# Altium project EEG.PrjPCB
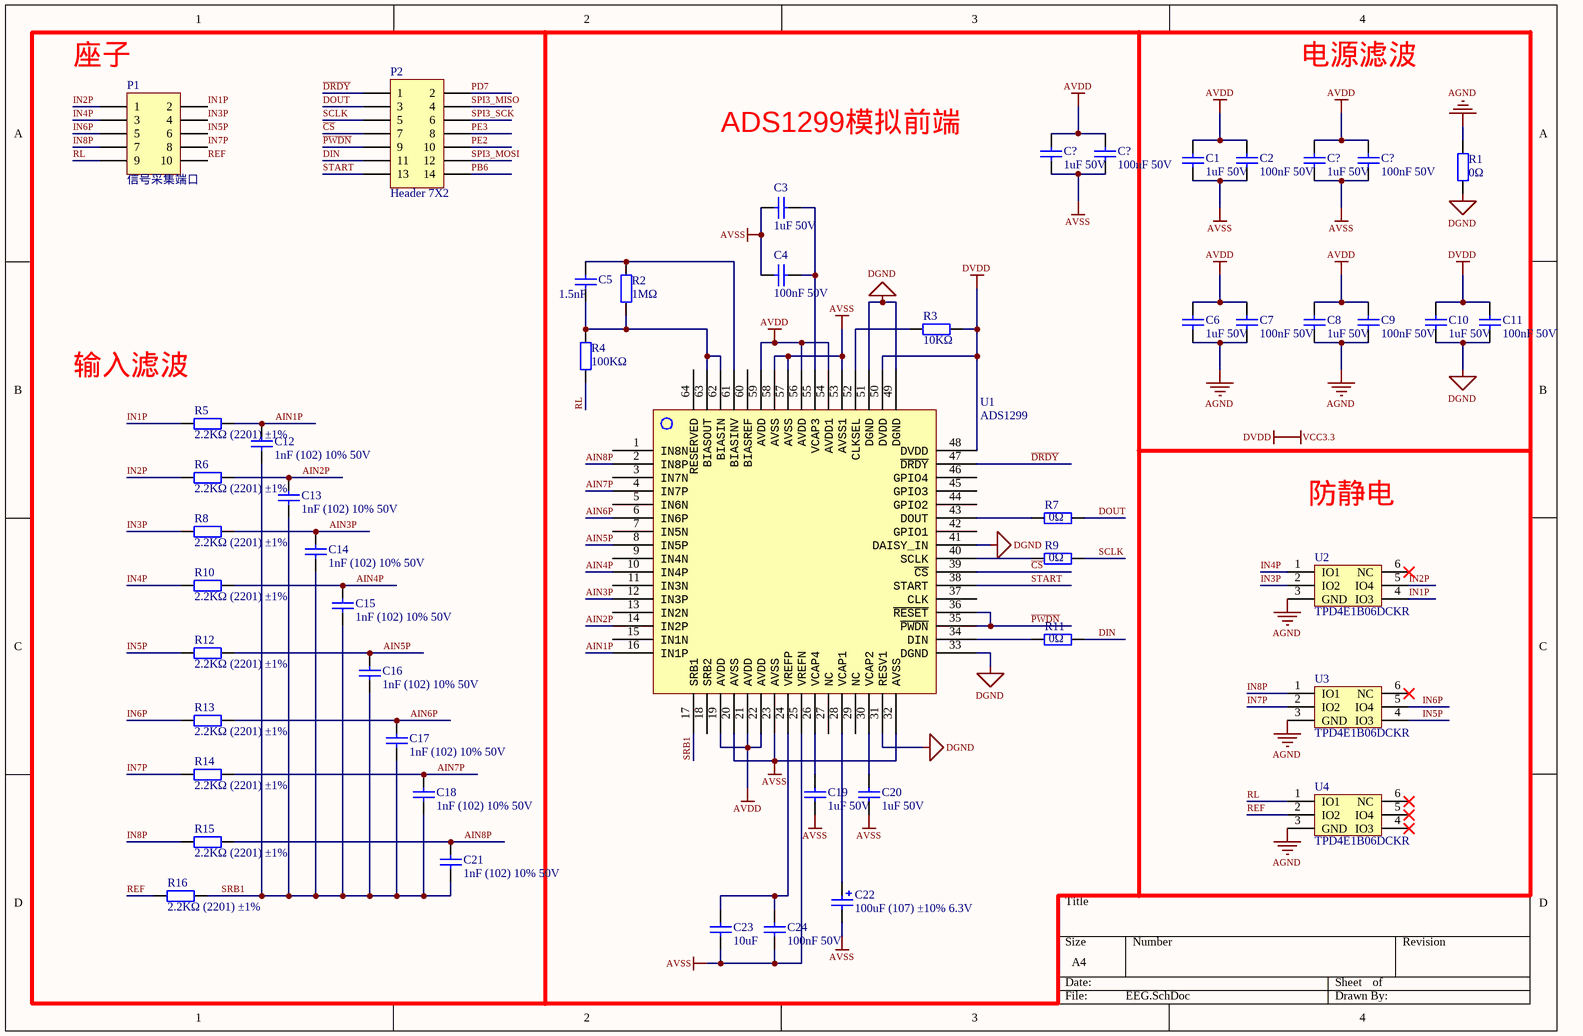
[diagram p0: EEG.SchDoc]
4 sheets, 168 parts. Net scope: global (net labels, ports and power ports of the same name join across sheets).
Board files: logo.PcbDoc, EEG_V3.0.PcbDoc
Sheets:
  EEG.SchDoc
  STM32F4.SchDoc
  pwr.SchDoc
  ble.SchDoc

## Sheet EEG.SchDoc
size A4

### Parts
(Parts that share a designator on the sheet are numbered #1, #2 ... from top to bottom, then left to right.)
C1#1  1uF 50V  [0402_C]
C2#1  100nF 50V  [0402_C]
C3#1  1uF 50V  [0402_C]
C4#1  100nF 50V  [0402_C]
C5#1  1.5nF  [0402_C]
C6#1  1uF 50V  [0402_C]
C7#1  100nF 50V  [0402_C]
C8#1  1uF 50V  [0402_C]
C9#1  100nF 50V  [0402_C]
C10#1  1uF 50V  [0402_C]
C11#1  100nF 50V  [0402_C]
C12#1  1nF (102) 10% 50V  [0402_C]
C13#1  1nF (102) 10% 50V  [0402_C]
C14#1  1nF (102) 10% 50V  [0402_C]
C15#1  1nF (102) 10% 50V  [0402_C]
C16#1  1nF (102) 10% 50V  [0402_C]
C17#1  1nF (102) 10% 50V  [0402_C]
C18#1  1nF (102) 10% 50V  [0402_C]
C19#1  1uF 50V  [0402_C]
C20#1  1uF 50V  [0402_C]
C21#1  1nF (102) 10% 50V  [0402_C]
C22#1  100uF (107) ±10% 6.3V  [CASE-B_3528]
C23#1  10uF  [0402_C]
C24#1  100nF 50V  [0402_C]
C?#1  1uF 50V  [0402_C]
C?#2  100nF 50V  [0402_C]
C?#3  1uF 50V  [0402_C]
C?#4  100nF 50V  [0402_C]
P1#1  信号采集端口  [HDR2X5]
P2#1  Header 7X2  [HDR2X7]
R1#1  0Ω  [0402_R]
R2#1  1MΩ  [0402_R]
R3#1  10KΩ  [0402_R]
R4  100KΩ  [0402_R]
R5#1  2.2KΩ (2201) ±1%  [0402_R]
R6#1  2.2KΩ (2201) ±1%  [0402_R]
R7#1  0Ω  [0402_R]
R8#1  2.2KΩ (2201) ±1%  [0402_R]
R9#1  0Ω  [0402_R]
R10#1  2.2KΩ (2201) ±1%  [0402_R]
R11#1  0Ω  [0402_R]
R12#1  2.2KΩ (2201) ±1%  [0402_R]
R13#1  2.2KΩ (2201) ±1%  [0402_R]
R14#1  2.2KΩ (2201) ±1%  [0402_R]
R15#1  2.2KΩ (2201) ±1%  [0402_R]
R16#1  2.2KΩ (2201) ±1%  [0402_R]
U1#1  ADS1299  [LQFP-64_10x10x05P]
U2#1  TPD4E1B06DCKR  [TPD4]
U3#1  TPD4E1B06DCKR  [TPD4]
U4#1  TPD4E1B06DCKR  [TPD4]

### Nets
AGND: C6#1.2 C7#1.2 C8#1.2 C9#1.2 R1#1.2 U2#1.3(GND) U3#1.3(GND) U4#1.3(GND)
AVDD: C1#1.1 C2#1.1 C6#1.1 C7#1.1 C8#1.1 C9#1.1 C?#1.1 C?#2.1 C?#3.1 C?#4.1 U1#1.19(AVDD) U1#1.21(AVDD) U1#1.22(AVDD) U1#1.54(AVDD1) U1#1.56(AVDD) U1#1.59(AVDD)
AVSS: C1#1.2 C2#1.2 C3#1.2 C4#1.2 C19#1.2 C20#1.2 C22#1.2 C23#1.1 C24#1.2 C?#1.2 C?#2.2 C?#3.2 C?#4.2 U1#1.20(AVSS) U1#1.23(AVSS) U1#1.25(VREFN) U1#1.32(AVSS) U1#1.53(AVSS1) U1#1.57(AVSS) U1#1.58(AVSS)
DGND: C10#1.2 C11#1.2 R1#1.1 U1#1.31(RESV1) U1#1.33(DGND) U1#1.41(DAISY_IN) U1#1.49(DGND) U1#1.51(DGND)
DVDD: C10#1.1 C11#1.1 R3#1.1 U1#1.48(DVDD) U1#1.50(DVDD)  [also labelled VCC3.3]
AIN1P: C12#1.2 R5#1.2 U1#1.16(IN1P)
AIN2P: C13#1.2 R6#1.2 U1#1.14(IN2P)
AIN3P: C14#1.2 R8#1.2 U1#1.12(IN3P)
AIN4P: C15#1.2 R10#1.2 U1#1.10(IN4P)
AIN5P: C16#1.2 R12#1.2 U1#1.8(IN5P)
AIN6P: C17#1.2 R13#1.2 U1#1.6(IN6P)
AIN7P: C18#1.2 R14#1.2 U1#1.4(IN7P)
AIN8P: C21#1.2 R15#1.2 U1#1.2(IN8P)
~{CS}: P2#1.7 U1#1.39(~{CS})
~{DRDY}: P2#1.1 U1#1.47(~{DRDY})
DIN: P2#1.11 R11#1.1
DOUT: P2#1.3 R7#1.1
IN1P: P1#1.2 R5#1.1 U2#1.4(IO3)
IN2P: P1#1.1 R6#1.1 U2#1.5(IO4)
IN3P: P1#1.4 R8#1.1 U2#1.2(IO2)
IN4P: P1#1.3 R10#1.1 U2#1.1(IO1)
IN5P: P1#1.6 R12#1.1 U3#1.4(IO3)
IN6P: P1#1.5 R13#1.1 U3#1.5(IO4)
IN7P: P1#1.8 R14#1.1 U3#1.2(IO2)
IN8P: P1#1.7 R15#1.1 U3#1.1(IO1)
~{PWDN}: P2#1.9 U1#1.35(~{PWDN}) U1#1.36(~{RESET})
PB6: P2#1.14
PD7: P2#1.2
PE2: P2#1.10
PE3: P2#1.8
REF: P1#1.10 R16#1.1 U4#1.2(IO2)
RL: P1#1.9 R4.1 U4#1.1(IO1)
SCLK: P2#1.5 R9#1.1
SPI3_MISO: P2#1.4
SPI3_MOSI: P2#1.12
SPI3_SCK: P2#1.6
SRB1: C12#1.1 C13#1.1 C14#1.1 C15#1.1 C16#1.1 C17#1.1 C18#1.1 C21#1.1 R16#1.2 U1#1.17(SRB1)
START: P2#1.13 U1#1.38(START)
NetC3#1_1: C3#1.1 C4#1.1 U1#1.55(VCAP3)
NetC5#1_1: C5#1.1 R2#1.1 R4.2 U1#1.62(BIASIN) U1#1.63(BIASOUT)
NetC5#1_2: C5#1.2 R2#1.2 U1#1.61(BIASINV)
NetC19#1_1: C19#1.1 U1#1.26(VCAP4)
NetC20#1_1: C20#1.1 U1#1.30(VCAP2)
NetC22#1_1: C22#1.1 U1#1.28(VCAP1)
NetC23#1_2: C23#1.2 C24#1.1 U1#1.24(VREFP)
NetR3#1_2: R3#1.2 U1#1.52(CLKSEL)
NetR7#1_2: R7#1.2 U1#1.43(DOUT)
NetR9#1_2: R9#1.2 U1#1.40(SCLK)
NetR11#1_2: R11#1.2 U1#1.34(DIN)

Not connected (* = marked no-connect by the designer): U1#1 1(IN8N) 3(IN7N) 5(IN6N) 7(IN5N) 9(IN4N) 11(IN3N) 13(IN2N) 15(IN1N) 18(SRB2) 27(NC) 29(NC) 37(CLK) 42(GPIO1) 44(GPIO2) 45(GPIO3) 46(GPIO4) 60(BIASREF) 64(RESERVED); U2#1 6(NC)*; U3#1 6(NC)*; U4#1 4(IO3)* 5(IO4)* 6(NC)*

### Notes on the sheet
- (near P1#1) 座子
- 电源滤波
- ADS1299模拟前端
- 输入滤波
- 防静电

### Library data of the parts
C1#1 C2#1 C3#1 C4#1 C5#1 C6#1 C7#1 C8#1 C9#1 C10#1 C11#1 C19#1 C20#1 C24#1 C?#1-C?#4 = 0603 10nF (103) 10% 50V: 贴片电容; ComponentLink1Description: 供应商链接; ComponentLink1URL: http://www.szlcsc.com/product/details_58143.html; Package: 0603; Supplier: LC; SuppliersPartNumber: C57112
C12#1 C13#1 C14#1 C15#1 C16#1 C17#1 C18#1 C21#1 = 0402 1nF (102) 10% 50V: 贴片电容; ComponentLink1Description: 供应商链接; ComponentLink1URL: http://www.szlcsc.com/product/details_1875.html; Package: 0402; Supplier: LC; SuppliersPartNumber: C1523
C22#1 = 3528 100uF (107) 10% 6.3V: 钽电容; ComponentLink1Description: 供应商链接; ComponentLink1URL: http://www.szlcsc.com/product/details_16815.html; Package: 3528; Supplier: LC; SuppliersPartNumber: C16133
C23#1 = 0603 10uF (106) 10% 10V: 贴片电容; ComponentLink1Description: 供应商链接; ComponentLink1URL: http://www.szlcsc.com/product/details_20411.html; Package: 0603; Supplier: LC; SuppliersPartNumber: C19702
P1#1 = Header 5X2: Header, 5-Pin, Dual row; LatestRevisionDate: 17-Jul-2002; LatestRevisionNote: Re-released for DXP Platform.; Publisher: Altium Limited
P2#1 = Header 7X2: Header, 7-Pin, Dual row; LatestRevisionDate: 17-Jul-2002; LatestRevisionNote: Re-released for DXP Platform.; Publisher: Altium Limited
R1#1 R7#1 R9#1 R11#1 = 0402 0Ω (0R0) 1%: 贴片电阻; ComponentLink1Description: 供应商链接; ComponentLink1URL: http://www.szlcsc.com/product/details_17853.html; Package: 0402; Supplier: LC; SuppliersPartNumber: C17168
R2#1 R4 = 0603 100KΩ (1003) 1%: 贴片电阻; ComponentLink1Description: 供应商链接; ComponentLink1URL: http://www.szlcsc.com/product/details_26546.html; Package: 0603; Supplier: LC; SuppliersPartNumber: C25803
R3#1 = 0603 10KΩ (1002) 1%: 贴片电阻; ComponentLink1Description: 供应商链接; ComponentLink1URL: http://www.szlcsc.com/product/details_26547.html; Package: 0603; Supplier: LC; SuppliersPartNumber: C25804
R5#1 R6#1 R8#1 R10#1 R12#1 R13#1 R14#1 R15#1 R16#1 = 0402 2.2KΩ (2201) 1%: 贴片电阻; ComponentLink1Description: 供应商链接; ComponentLink1URL: http://www.szlcsc.com/product/details_26622.html; Package: 0402; Supplier: LC; SuppliersPartNumber: C25879

## Sheet STM32F4.SchDoc
size A3
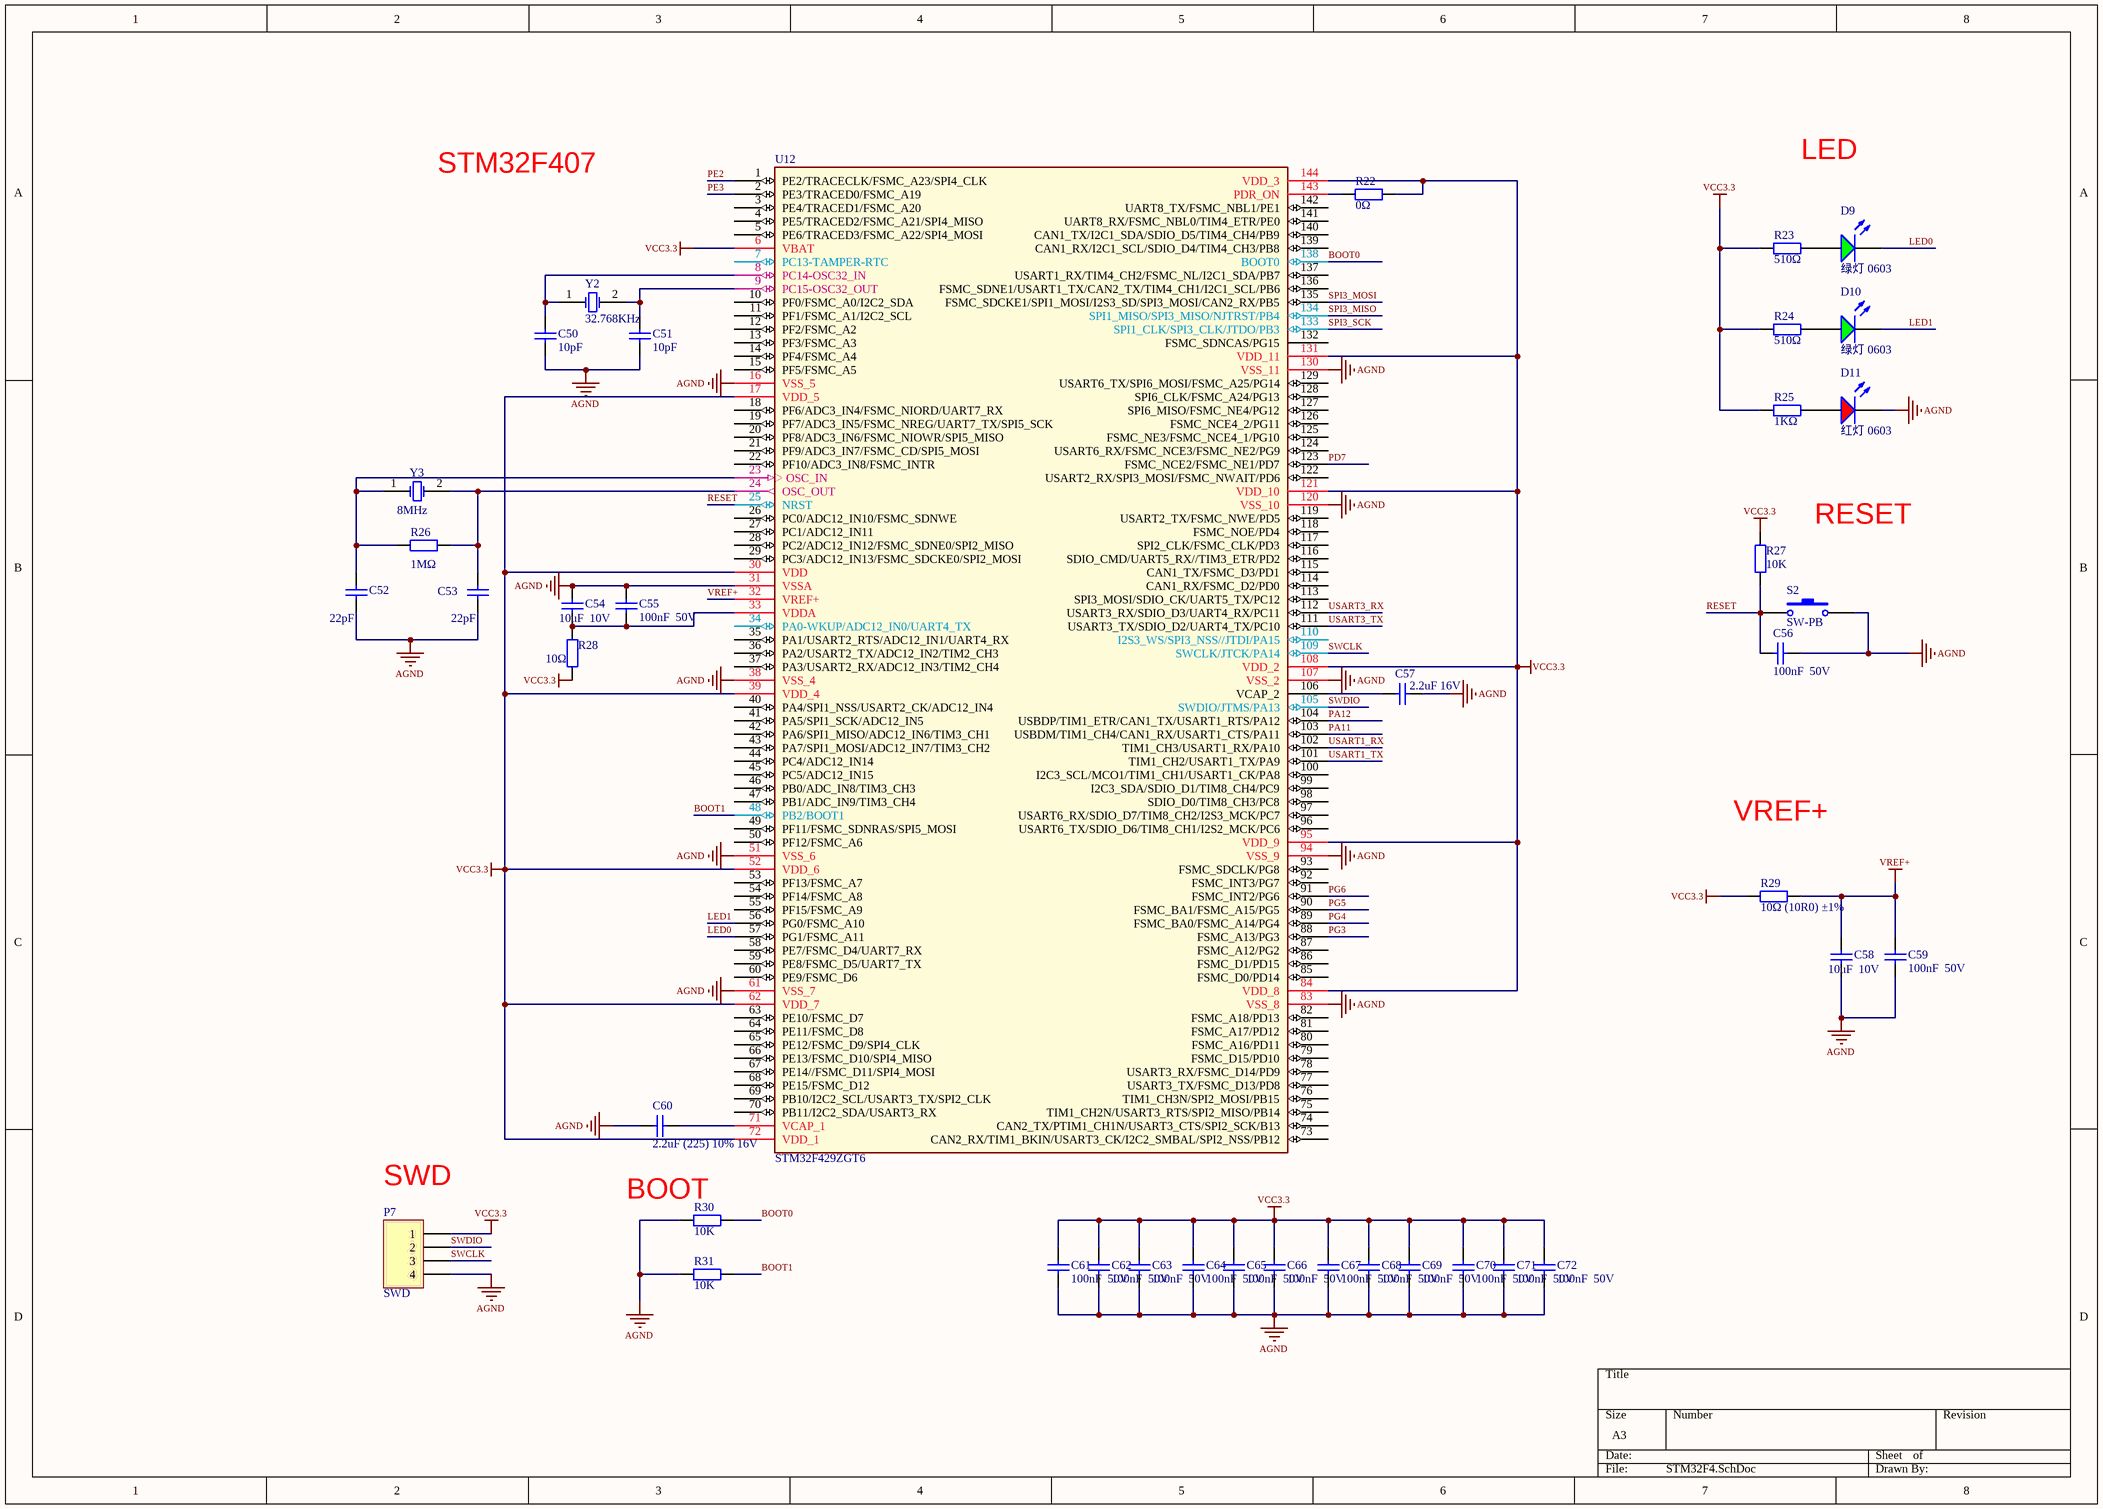
[diagram p1: STM32F4.SchDoc]

### Parts
(Parts that share a designator on the sheet are numbered #1, #2 ... from top to bottom, then left to right.)
C50  10pF  [0402_C]
C51  10pF  [0402_C]
C52  22pF  [0402_C]
C53  22pF  [0402_C]
C54  10uF  10V  [0402_C]
C55  100nF  50V  [0402_C]
C56  100nF  50V  [0402_C]
C57  2.2uF 16V  [0603_C]
C58  10uF  10V  [0402_C]
C59  100nF  50V  [0402_C]
C60  2.2uF (225) 10% 16V  [0603_C]
C61  100nF  50V  [0402_C]
C62  100nF  50V  [0402_C]
C63  100nF  50V  [0402_C]
C64  100nF  50V  [0402_C]
C65  100nF  50V  [0402_C]
C66  100nF  50V  [0402_C]
C67  100nF  50V  [0402_C]
C68  100nF  50V  [0402_C]
C69  100nF  50V  [0402_C]
C70  100nF  50V  [0402_C]
C71  100nF  50V  [0402_C]
C72  100nF  50V  [0402_C]
D9  绿灯 0603  [0603_LED_S1]
D10  绿灯 0603  [0603_LED_S1]
D11  红灯 0603  [0603_LED_S1]
P7  SWD  [HDR1X4]
R22  0Ω  [0402_R]
R23  510Ω  [0402_R]
R24  510Ω  [0402_R]
R25  1KΩ  [0402_R]
R26  1MΩ  [0402_R]
R27  10K  [0402_R]
R28  10Ω  [0402_R]
R29  10Ω (10R0) ±1%  [0402_R]
R30  10K  [0402_R]
R31  10K  [0402_R]
S2  SW-PB  [key_4.5*4.5*3.8]
U12  STM32F429ZGT6  [LQFP-144_20x20x05P]
Y2  32.768KHz  [SMD-3215_2P FC - 135]
Y3#1  8MHz  [SMD-5032_2P]

### Nets
AGND: C50.1 C51.1 C52.1 C53.1 C54.2 C55.2 C56.1 C57.1 C58.1 C59.1 C60.1 C61.1 C62.1 C63.1 C64.1 C65.1 C66.1 C67.1 C68.1 C69.1 C70.1 C71.1 C72.1 D11.K P7.4 R30.1 R31.1 S2.2 U12.16(VSS_5) U12.31(VSSA) U12.38(VSS_4) U12.51(VSS_6) U12.61(VSS_7) U12.83(VSS_8) U12.94(VSS_9) U12.107(VSS_2) U12.120(VSS_10) U12.130(VSS_11)
VCC3.3: C61.2 C62.2 C63.2 C64.2 C65.2 C66.2 C67.2 C68.2 C69.2 C70.2 C71.2 C72.2 P7.1 R22.1 R23.1 R24.1 R25.1 R27.1 R28.1 R29.2 U12.6(VBAT) U12.17(VDD_5) U12.30(VDD) U12.39(VDD_4) U12.52(VDD_6) U12.62(VDD_7) U12.72(VDD_1) U12.84(VDD_8) U12.95(VDD_9) U12.108(VDD_2) U12.121(VDD_10) U12.131(VDD_11) U12.144(VDD_3)  [project net DVDD]
VREF+: C58.2 C59.2 R29.1 U12.32(VREF+)
BOOT0: R30.2 U12.138(BOOT0)
BOOT1: R31.2 U12.48(PB2/BOOT1)
LED0: D9.K U12.57(PG1/FSMC_A11)
LED1: D10.K U12.56(PG0/FSMC_A10)
PA11: U12.103(USBDM/TIM1_CH4/CAN1_RX/USART1_CTS/PA11)
PA12: U12.104(USBDP/TIM1_ETR/CAN1_TX/USART1_RTS/PA12)
PD7: U12.123(FSMC_NCE2/FSMC_NE1/PD7)
PE2: U12.1(PE2/TRACECLK/FSMC_A23/SPI4_CLK)
PE3: U12.2(PE3/TRACED0/FSMC_A19)
PG3: U12.88(FSMC_A13/PG3)
PG4: U12.89(FSMC_BA0/FSMC_A14/PG4)
PG5: U12.90(FSMC_BA1/FSMC_A15/PG5)
PG6: U12.91(FSMC_INT2/PG6)
RESET: C56.2 R27.2 S2.1 U12.25(NRST)
SPI3_MISO: U12.134(SPI1_MISO/SPI3_MISO/NJTRST/PB4)
SPI3_MOSI: U12.135(FSMC_SDCKE1/SPI1_MOSI/I2S3_SD/SPI3_MOSI/CAN2_RX/PB5)
SPI3_SCK: U12.133(SPI1_CLK/SPI3_CLK/JTDO/PB3)
SWCLK: P7.3 U12.109(SWCLK/JTCK/PA14)
SWDIO: P7.2 U12.105(SWDIO/JTMS/PA13)
USART1_RX: U12.102(TIM1_CH3/USART1_RX/PA10)
USART1_TX: U12.101(TIM1_CH2/USART1_TX/PA9)
USART3_RX: U12.112(USART3_RX/SDIO_D3/UART4_RX/PC11)
USART3_TX: U12.111(USART3_TX/SDIO_D2/UART4_TX/PC10)
NetC50_2: C50.2 U12.8(PC14-OSC32_IN) Y2.1(OSC1)
NetC51_2: C51.2 U12.9(PC15-OSC32_OUT) Y2.2(OSC2)
NetC52_2: C52.2 R26.1 U12.23(OSC_IN) Y3#1.1(OSC1)
NetC53_2: C53.2 R26.2 U12.24(OSC_OUT) Y3#1.2(OSC2)
NetC54_1: C54.1 C55.1 R28.2 U12.33(VDDA)
NetC57_2: C57.2 U12.106(VCAP_2)
NetC60_2: C60.2 U12.71(VCAP_1)
NetD9_A: D9.A R23.2
NetD10_A: D10.A R24.2
NetD11_A: D11.A R25.2
NetR22_2: R22.2 U12.143(PDR_ON)

Not connected (* = marked no-connect by the designer): U12 3(PE4/TRACED1/FSMC_A20) 4(PE5/TRACED2/FSMC_A21/SPI4_MISO) 5(PE6/TRACED3/FSMC_A22/SPI4_MOSI) 7(PC13-TAMPER-RTC) 10(PF0/FSMC_A0/I2C2_SDA) 11(PF1/FSMC_A1/I2C2_SCL) 12(PF2/FSMC_A2) 13(PF3/FSMC_A3) 14(PF4/FSMC_A4) 15(PF5/FSMC_A5) 18(PF6/ADC3_IN4/FSMC_NIORD/UART7_RX) 19(PF7/ADC3_IN5/FSMC_NREG/UART7_TX/SPI5_SCK) 20(PF8/ADC3_IN6/FSMC_NIOWR/SPI5_MISO) 21(PF9/ADC3_IN7/FSMC_CD/SPI5_MOSI) 22(PF10/ADC3_IN8/FSMC_INTR) 26(PC0/ADC12_IN10/FSMC_SDNWE) 27(PC1/ADC12_IN11) 28(PC2/ADC12_IN12/FSMC_SDNE0/SPI2_MISO) 29(PC3/ADC12_IN13/FSMC_SDCKE0/SPI2_MOSI) 34(PA0-WKUP/ADC12_IN0/UART4_TX) 35(PA1/USART2_RTS/ADC12_IN1/UART4_RX) 36(PA2/USART2_TX/ADC12_IN2/TIM2_CH3) 37(PA3/USART2_RX/ADC12_IN3/TIM2_CH4) 40(PA4/SPI1_NSS/USART2_CK/ADC12_IN4) 41(PA5/SPI1_SCK/ADC12_IN5) 42(PA6/SPI1_MISO/ADC12_IN6/TIM3_CH1) 43(PA7/SPI1_MOSI/ADC12_IN7/TIM3_CH2) 44(PC4/ADC12_IN14) 45(PC5/ADC12_IN15) 46(PB0/ADC_IN8/TIM3_CH3) 47(PB1/ADC_IN9/TIM3_CH4) 49(PF11/FSMC_SDNRAS/SPI5_MOSI) 50(PF12/FSMC_A6) 53(PF13/FSMC_A7) 54(PF14/FSMC_A8) 55(PF15/FSMC_A9) 58(PE7/FSMC_D4/UART7_RX) 59(PE8/FSMC_D5/UART7_TX) 60(PE9/FSMC_D6) 63(PE10/FSMC_D7) 64(PE11/FSMC_D8) 65(PE12/FSMC_D9/SPI4_CLK) 66(PE13/FSMC_D10/SPI4_MISO) 67(PE14//FSMC_D11/SPI4_MOSI) 68(PE15/FSMC_D12) 69(PB10/I2C2_SCL/USART3_TX/SPI2_CLK) 70(PB11/I2C2_SDA/USART3_RX) 73(CAN2_RX/TIM1_BKIN/USART3_CK/I2C2_SMBAL/SPI2_NSS/PB12) 74(CAN2_TX/PTIM1_CH1N/USART3_CTS/SPI2_SCK/B13) 75(TIM1_CH2N/USART3_RTS/SPI2_MISO/PB14) 76(TIM1_CH3N/SPI2_MOSI/PB15) 77(USART3_TX/FSMC_D13/PD8) 78(USART3_RX/FSMC_D14/PD9) 79(FSMC_D15/PD10) 80(FSMC_A16/PD11) 81(FSMC_A17/PD12) 82(FSMC_A18/PD13) 85(FSMC_D0/PD14) 86(FSMC_D1/PD15) 87(FSMC_A12/PG2) 92(FSMC_INT3/PG7) 93(FSMC_SDCLK/PG8) 96(USART6_TX/SDIO_D6/TIM8_CH1/I2S2_MCK/PC6) 97(USART6_RX/SDIO_D7/TIM8_CH2/I2S3_MCK/PC7) 98(SDIO_D0/TIM8_CH3/PC8) 99(I2C3_SDA/SDIO_D1/TIM8_CH4/PC9) 100(I2C3_SCL/MCO1/TIM1_CH1/USART1_CK/PA8) 110(I2S3_WS/SPI3_NSS//JTDI/PA15) 113(SPI3_MOSI/SDIO_CK/UART5_TX/PC12) 114(CAN1_RX/FSMC_D2/PD0) 115(CAN1_TX/FSMC_D3/PD1) 116(SDIO_CMD/UART5_RX//TIM3_ETR/PD2) 117(SPI2_CLK/FSMC_CLK/PD3) 118(FSMC_NOE/PD4) 119(USART2_TX/FSMC_NWE/PD5) 122(USART2_RX/SPI3_MOSI/FSMC_NWAIT/PD6) 124(USART6_RX/FSMC_NCE3/FSMC_NE2/PG9) 125(FSMC_NE3/FSMC_NCE4_1/PG10) 126(FSMC_NCE4_2/PG11) 127(SPI6_MISO/FSMC_NE4/PG12) 128(SPI6_CLK/FSMC_A24/PG13) 129(USART6_TX/SPI6_MOSI/FSMC_A25/PG14) 132(FSMC_SDNCAS/PG15) 136(FSMC_SDNE1/USART1_TX/CAN2_TX/TIM4_CH1/I2C1_SCL/PB6) 137(USART1_RX/TIM4_CH2/FSMC_NL/I2C1_SDA/PB7) 139(CAN1_RX/I2C1_SCL/SDIO_D4/TIM4_CH3/PB8) 140(CAN1_TX/I2C1_SDA/SDIO_D5/TIM4_CH4/PB9) 141(UART8_RX/FSMC_NBL0/TIM4_ETR/PE0) 142(UART8_TX/FSMC_NBL1/PE1)

### Notes on the sheet
- STM32F407
- LED
- RESET
- VREF+
- (near P7) SWD
- (near R30) BOOT

### Library data of the parts
C50 C51 = 0603 10pF (100) 5% 50V: 贴片电容; ComponentLink1Description: 供应商链接; ComponentLink1URL: http://www.szlcsc.com/product/details_1986.html; Package: 0603; Supplier: LC; SuppliersPartNumber: C1634
C52 C53 = 0603 22pF (220) 5% 50V: 贴片电容; ComponentLink1Description: 供应商链接; ComponentLink1URL: http://www.szlcsc.com/product/details_2005.html; Package: 0603; Supplier: LC; SuppliersPartNumber: C1653
C54 C58 = 0603 10uF (106) 10% 10V: 贴片电容; ComponentLink1Description: 供应商链接; ComponentLink1URL: http://www.szlcsc.com/product/details_20411.html; Package: 0603; Supplier: LC; SuppliersPartNumber: C19702
C55 C56 C59 C61-C72 = 0603 100nF (104) 10% 50V: 贴片电容; ComponentLink1Description: 供应商链接; ComponentLink1URL: http://www.szlcsc.com/product/details_15331.html; Package: 0603; Supplier: LC; SuppliersPartNumber: C14663
C57 C60 = 0603 2.2uF (225) 10% 16V: 贴片电容; ComponentLink1Description: 供应商链接; ComponentLink1URL: http://www.szlcsc.com/product/details_24366.html; Package: 0603; Supplier: LC; SuppliersPartNumber: C23630
D9 D10 = 0603 绿灯: 发光二极管; ComponentLink1Description: 供应商链接; ComponentLink1URL: http://www.szlcsc.com/product/details_73152.html; Package: 0603; Supplier: LC; SuppliersPartNumber: C72043
D11 = 0603 红灯: 发光二极管; ComponentLink1Description: 供应商链接; ComponentLink1URL: http://www.szlcsc.com/product/details_2659.html; Package: 0603; Supplier: LC; SuppliersPartNumber: C2286
P7 = Header 4: Header, 4-Pin; LatestRevisionDate: 17-Jul-2002; LatestRevisionNote: Re-released for DXP Platform.; Publisher: Altium Limited
R22 = 0603 0Ω (0R0) 1%: 贴片电阻; ComponentLink1Description: 供应商链接; ComponentLink1URL: http://www.szlcsc.com/product/details_21903.html; Package: 0603; Supplier: LC; SuppliersPartNumber: C21189
R23 R24 = 0603 510Ω (5100) 1%: 贴片电阻; ComponentLink1Description: 供应商链接; ComponentLink1URL: http://www.szlcsc.com/product/details_23920.html; Package: 0603; Supplier: LC; SuppliersPartNumber: C23193
R25 = 0603 1KΩ (1001) 1%: 贴片电阻; ComponentLink1Description: 供应商链接; ComponentLink1URL: http://www.szlcsc.com/product/details_21904.html; Package: 0603; Supplier: LC; SuppliersPartNumber: C21190
R26 = 0603 1.2MΩ (1204) 1%: 贴片电阻; ComponentLink1Description: 供应商链接; ComponentLink1URL: http://www.szlcsc.com/product/details_23493.html; Package: 0603; Supplier: LC; SuppliersPartNumber: C22766
R27-R31 = 0603 10Ω (10R0) 1%: 贴片电阻; ComponentLink1Description: 供应商链接; ComponentLink1URL: http://www.szlcsc.com/product/details_23586.html; Package: 0603; Supplier: LC; SuppliersPartNumber: C22859
S2 = SW-PB: Switch; Published: 24-Mar-1999; LatestRevisionDate: 17-Jul-2002; LatestRevisionNote: Re-released for DXP Platform.; PackageReference: SPST-2; Publisher: Altium Limited; PackageDescription: Switch; 2 Leads
U12 = STM32F429ZGT6: ARM; ComponentLink1Description: 供应商链接; ComponentLink1URL: http://www.szlcsc.com/product/details_47529.html; Package: LQFP-144_20x20x05P; Supplier: LC; SuppliersPartNumber: C46525
Y2 = SMD-3215_2P 32.768KHz 20ppm 12.5pF: 贴片晶振; ComponentLink1Description: 供应商链接; ComponentLink1URL: http://www.szlcsc.com/product/details_33310.html; Package: SMD-3215_2P; Supplier: LC; SuppliersPartNumber: C32346
Y3#1 = SMD-5032_2P 8MHz 20ppm 20pF: 贴片晶振; ComponentLink1Description: 供应商链接; ComponentLink1URL: http://www.szlcsc.com/product/details_117214.html; Package: SMD-5032_2P; Supplier: LC; SuppliersPartNumber: C115962

## Sheet pwr.SchDoc
size A4
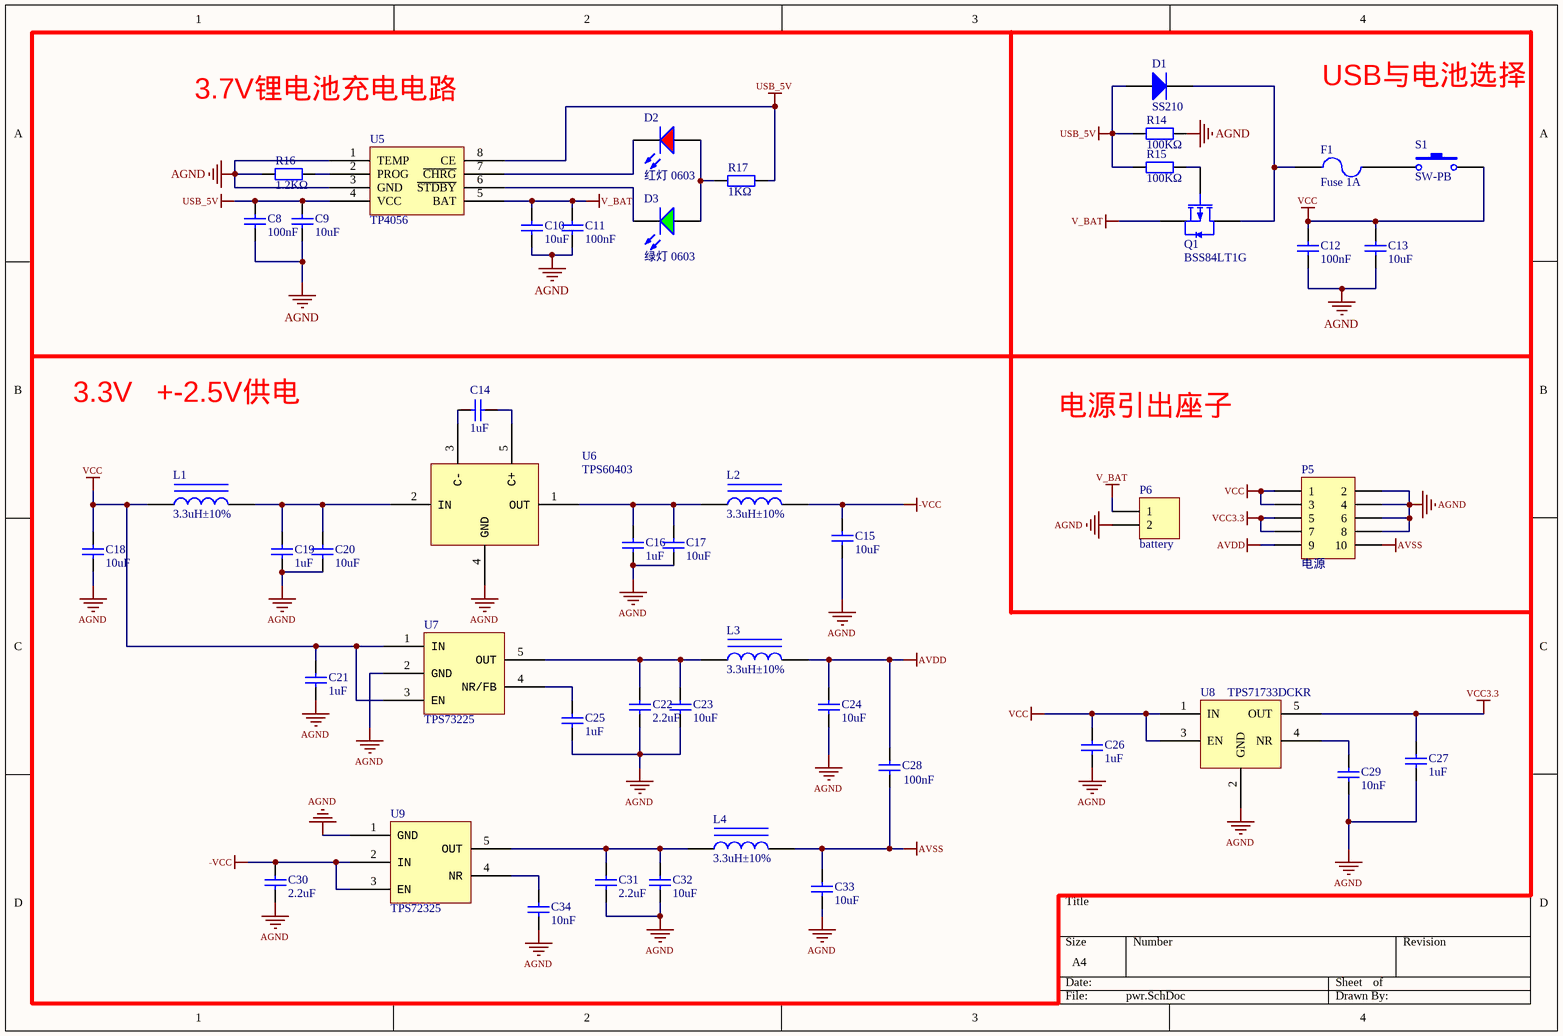
[diagram p2: pwr.SchDoc]

### Parts
(Parts that share a designator on the sheet are numbered #1, #2 ... from top to bottom, then left to right.)
C8#2  100nF  [0402_C]
C9#2  10uF  [0402_C]
C10#2  10uF  [0402_C]
C11#2  100nF  [0402_C]
C12#2  100nF  [0402_C]
C13#2  10uF  [0402_C]
C14#2  1uF  [0402_C]
C15#2  10uF  [0402_C]
C16#2  1uF  [0402_C]
C17#2  10uF  [0402_C]
C18#2  10uF  [0402_C]
C19#2  1uF  [0402_C]
C20#2  10uF  [0402_C]
C21#2  1uF  [0402_C]
C22#2  2.2uF  [0603_C]
C23#2  10uF  [0402_C]
C24#2  10uF  [0402_C]
C25  1uF  [0402_C]
C26  1uF  [0402_C]
C27  1uF  [0402_C]
C28  100nF  [0402_C]
C29  10nF  [0402_C]
C30  2.2uF  [0603_C]
C31  2.2uF  [0603_C]
C32  10uF  [0402_C]
C33  10uF  [0402_C]
C34  10nF  [0402_C]
D1  SS210  [SMA(DO-214AC)_S1]
D2  红灯 0603  [0603_LED_S1]
D3  绿灯 0603  [0603_LED_S1]
F1  Fuse 1A  [0805_R]
L1  3.3uH±10%  [0805_L]
L2  3.3uH±10%  [0805_L]
L3  3.3uH±10%  [0805_L]
L4  3.3uH±10%  [0805_L]
P5  电源  [HDR2X5]
P6  battery  [HDR1X2]
Q1  BSS84LT1G  [SOT-23(SOT-23-3)]
R14#2  100KΩ  [0402_R]
R15#2  100KΩ  [0402_R]
R16#2  1.2KΩ  [0402_R]
R17  1KΩ  [0402_R]
S1  SW-PB  [KEY_5.8*5.8]
U5  TP4056  [SOP-8_EP_150mil]
U6  TPS60403  [SOT-23-5]
U7  TPS73225  [SOT-23-5]
U8  TPS71733DCKR  [SC-70-5]
U9  TPS72325  [SOT-23-5]

### Nets
-VCC: C15#2.2 C30.2 L2.2 U9.2(IN) U9.3(EN)
AGND: C8#2.1 C9#2.1 C10#2.1 C11#2.1 C12#2.1 C13#2.1 C15#2.1 C16#2.1 C17#2.1 C18#2.1 C19#2.1 C20#2.1 C21#2.1 C22#2.1 C23#2.1 C24#2.1 C25.1 C26.1 C27.1 C29.1 C30.1 C31.1 C32.1 C33.1 C34.1 P5.2 P5.4 P5.6 P5.8 P6.2 R14#2.2 R16#2.1 U5.1(TEMP) U5.3(GND) U6.4(GND) U7.2(GND) U8.2(GND) U9.1(GND)
AVDD: C24#2.2 C28.2 L3.2 P5.9
AVSS: C28.1 C33.2 L4.2 P5.10
USB_5V: C8#2.2 C9#2.2 D1.1(A) R14#2.1 R15#2.1 R17.2 U5.4(VCC) U5.8(CE)
V_BAT: C10#2.2 C11#2.2 P6.1 Q1.2(S) U5.5(BAT)
VCC: C12#2.2 C13#2.2 C18#2.2 C21#2.2 C26.2 L1.1 P5.1 P5.3 S1.2 U7.1(IN) U7.3(EN) U8.1(IN) U8.3(EN)
VCC3.3: C27.2 P5.5 P5.7 U8.5(OUT)  [project net DVDD]
NetC14#2_1: C14#2.1 U6.5(C+)
NetC14#2_2: C14#2.2 U6.3(C-)
NetC16#2_2: C16#2.2 C17#2.2 L2.1 U6.1(OUT)
NetC19#2_2: C19#2.2 C20#2.2 L1.2 U6.2(IN)
NetC22#2_2: C22#2.2 C23#2.2 L3.1 U7.5(OUT)
NetC25_2: C25.2 U7.4(NR/FB)
NetC29_2: C29.2 U8.4(NR)
NetC31_2: C31.2 C32.2 L4.1 U9.5(OUT)
NetC34_2: C34.2 U9.4(NR)
NetD1_2: D1.2(K) F1.1 Q1.3(D)
NetD2_A: D2.A D3.A R17.1
NetD2_K: D2.K U5.7(~{CHRG})
NetD3_K: D3.K U5.6(~{STDBY})
NetF1_2: F1.2 S1.1
NetQ1_1: Q1.1(G) R15#2.2
NetR16#2_2: R16#2.2 U5.2(PROG)

### Notes on the sheet
- 3.7V锂电池充电电路
- USB与电池选择
- 3.3V   +-2.5V供电
- 电源引出座子

### Library data of the parts
C8#2 C11#2 C12#2 C28 = 0402 100nF (104) 10% 16V: 贴片电容; ComponentLink1Description: 供应商链接; ComponentLink1URL: http://www.szlcsc.com/product/details_1877.html; Package: 0402; Supplier: LC; SuppliersPartNumber: C1525
C9#2 C10#2 C13#2 C15#2 C17#2 C18#2 C20#2 C23#2 C24#2 C32 C33 = 0402 10uF (106) 20% 6.3V: 贴片电容; ComponentLink1Description: 供应商链接; ComponentLink1URL: http://www.szlcsc.com/product/details_16204.html; Package: 0402; Supplier: LC; SuppliersPartNumber: C15525
C14#2 C16#2 C19#2 C21#2 C25-C27 = 0603 1uF (105) 10% 50V: 贴片电容; ComponentLink1Description: 供应商链接; ComponentLink1URL: http://www.szlcsc.com/product/details_16531.html; Package: 0603; Supplier: LC; SuppliersPartNumber: C15849
C22#2 C30 C31 = 0603 2.2uF (225) 10% 16V: 贴片电容; ComponentLink1Description: 供应商链接; ComponentLink1URL: http://www.szlcsc.com/product/details_24366.html; Package: 0603; Supplier: LC; SuppliersPartNumber: C23630
C29 C34 = 0402 10nF (103) 10% 50V: 贴片电容; ComponentLink1Description: 供应商链接; ComponentLink1URL: http://www.szlcsc.com/product/details_15869.html; Package: 0402; Supplier: LC; SuppliersPartNumber: C15195
D1 = SMA(DO-214AC) SS210: 二极管; ComponentLink1Description: 供应商链接; ComponentLink1URL: http://www.szlcsc.com/product/details_15669.html; Package: SMA(DO-214AC); Supplier: LC; SuppliersPartNumber: C14996
D2 = 0603 红灯: 发光二极管; ComponentLink1Description: 供应商链接; ComponentLink1URL: http://www.szlcsc.com/product/details_2659.html; Package: 0603; Supplier: LC; SuppliersPartNumber: C2286
D3 = 0603 绿灯: 发光二极管; ComponentLink1Description: 供应商链接; ComponentLink1URL: http://www.szlcsc.com/product/details_73152.html; Package: 0603; Supplier: LC; SuppliersPartNumber: C72043
F1 = Fuse 2: Fuse; Published: 8-Jun-2000; LatestRevisionDate: 17-Jul-2002; LatestRevisionNote: Re-released for DXP Platform.; PackageReference: PIN-W2/E2.8; Publisher: Altium Limited; PackageDescription: Thru-Hole; 2 Leads
L1-L4 = 0805 3.3uH10%: 贴片电感; ComponentLink1Description: 供应商链接; ComponentLink1URL: http://www.szlcsc.com/product/details_52738.html; Package: 0805; Supplier: LC; SuppliersPartNumber: C51725
P5 = Header 5X2: Header, 5-Pin, Dual row; LatestRevisionDate: 17-Jul-2002; LatestRevisionNote: Re-released for DXP Platform.; Publisher: Altium Limited
P6 = Header 2: Header, 2-Pin; LatestRevisionDate: 17-Jul-2002; LatestRevisionNote: Re-released for DXP Platform.; Publisher: Altium Limited
Q1 = BSS84LT1G: MOS(场效应管); ComponentLink1Description: 供应商链接; ComponentLink1URL: http://www.szlcsc.com/product/details_8986.html; Package: SOT-23(SOT-23-3); Supplier: LC; SuppliersPartNumber: C8492
R14#2 R15#2 = 0402 100KΩ (1003) 1%: 贴片电阻; ComponentLink1Description: 供应商链接; ComponentLink1URL: http://www.szlcsc.com/product/details_26484.html; Package: 0402; Supplier: LC; SuppliersPartNumber: C25741
R16#2 = 0402 1.2KΩ (1201) 1%: 贴片电阻; ComponentLink1Description: 供应商链接; ComponentLink1URL: http://www.szlcsc.com/product/details_26605.html; Package: 0402; Supplier: LC; SuppliersPartNumber: C25862
R17 = 0402 1KΩ (1001) 1%: 贴片电阻; ComponentLink1Description: 供应商链接; ComponentLink1URL: http://www.szlcsc.com/product/details_12256.html; Package: 0402; Supplier: LC; SuppliersPartNumber: C11702
S1 = SW-PB: Switch; Published: 24-Mar-1999; LatestRevisionDate: 17-Jul-2002; LatestRevisionNote: Re-released for DXP Platform.; PackageReference: SPST-2; Publisher: Altium Limited; PackageDescription: Switch; 2 Leads
U5 = TP4056_[C16581]: 电池电源管理; ComponentLink1Description: 供应商链接; ComponentLink1URL: http://www.szlcsc.com/product/details_17264.html; Package: SOP-8_EP_150mil; Supplier: LC; SuppliersPartNumber: C16581

## Sheet ble.SchDoc
size A4
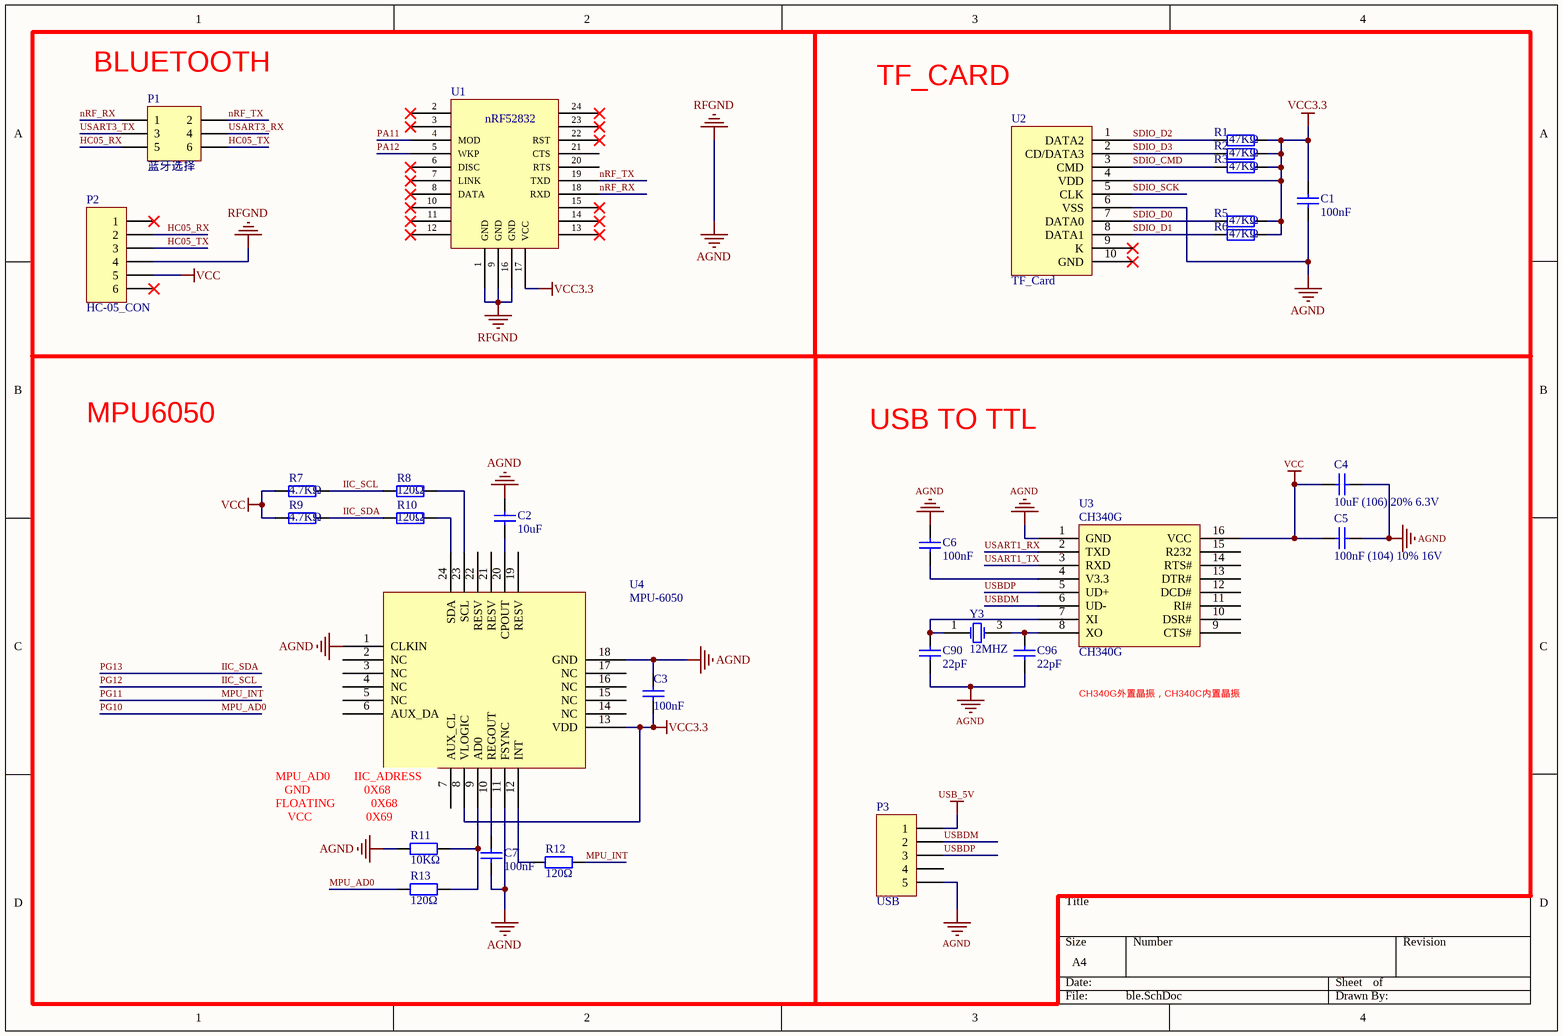
[diagram p3: ble.SchDoc]

### Parts
(Parts that share a designator on the sheet are numbered #1, #2 ... from top to bottom, then left to right.)
C1#2  100nF  [0402_C]
C2#2  10uF  [0402_C]
C3#2  100nF  [0402_C]
C4#2  10uF (106) 20% 6.3V  [0402_C]
C5#2  100nF (104) 10% 16V  [0402_C]
C6#2  100nF  [0402_C]
C7#2  100nF  [0402_C]
C90  22pF  [0402_C]
C96  22pF  [0402_C]
P1#2  蓝牙选择  [HDR2X3]
P2#2  HC-05_CON  [HDR1X6]
P3  USB  [MICRO-USB]
R1#2  47KΩ  [0402_R]
R2#2  47KΩ  [0402_R]
R3#2  47KΩ  [0402_R]
R5#2  47KΩ  [0402_R]
R6#2  47KΩ  [0402_R]
R7#2  4.7KΩ  [0402_R]
R8#2  120Ω  [0402_R]
R9#2  4.7KΩ  [0402_R]
R10#2  120Ω  [0402_R]
R11#2  10KΩ  [0402_R]
R12#2  120Ω  [0402_R]
R13#2  120Ω  [0402_R]
U1#2  nRF52832  [nRF52832]
U2#2  TF_Card  [TF_1]
U3#2  CH340G  [SOIC-16_150mil]
U4#2  MPU-6050  [QFN-24_4x4x05P]
Y3#2  12MHZ  [SMD-3225_4P]

### Nets
AGND: C1#2.1 C2#2.2 C3#2.2 C4#2.2 C5#2.2 C6#2.2 C7#2.1 C90.1 C96.1 P2#2.4 P3.5 R11#2.2 U1#2.1(GND) U1#2.9(GND) U1#2.16(GND) U2#2.6(VSS) U3#2.1(GND) U4#2.1(CLKIN) U4#2.11(FSYNC) U4#2.18(GND)  [also labelled RFGND]
USB_5V: P3.1
VCC: C4#2.1 C5#2.1 P2#2.5 R7#2.1 R9#2.1 U3#2.16(VCC)
VCC3.3: C1#2.2 C3#2.1 R1#2.2 R2#2.2 R3#2.2 R5#2.2 R6#2.2 U1#2.17(VCC) U2#2.4(VDD) U4#2.8(VLOGIC) U4#2.13(VDD)  [project net DVDD]
HC05_RX: P1#2.5 P2#2.2
HC05_TX: P1#2.6 P2#2.3
IIC_SCL: R7#2.2 R8#2.2  [also labelled PG12]
IIC_SDA: R9#2.2 R10#2.2  [also labelled PG13]
MPU_AD0: R13#2.2  [also labelled PG10]
MPU_INT: R12#2.1  [also labelled PG11]
nRF_RX: P1#2.1 U1#2.18(RXD)
nRF_TX: P1#2.2 U1#2.19(TXD)
PA11: U1#2.4(MOD)
PA12: U1#2.5(WKP)
SDIO_CMD: R3#2.1 U2#2.3(CMD)
SDIO_D0: R5#2.1 U2#2.7(DATA0)
SDIO_D1: R6#2.1 U2#2.8(DATA1)
SDIO_D2: R1#2.1 U2#2.1(DATA2)
SDIO_D3: R2#2.1 U2#2.2(CD/DATA3)
SDIO_SCK: U2#2.5(CLK)
USART1_RX: U3#2.2(TXD)
USART1_TX: U3#2.3(RXD)
USART3_RX: P1#2.4
USART3_TX: P1#2.3
USBDM: P3.2 U3#2.6(UD-)
USBDP: P3.3 U3#2.5(UD+)
NetC2#2_1: C2#2.1 U4#2.20(CPOUT)
NetC6#2_1: C6#2.1 U3#2.4(V3.3)
NetC7#2_2: C7#2.2 U4#2.10(REGOUT)
NetC90_2: C90.2 U3#2.7(XI) Y3#2.1(OSC1)
NetC96_2: C96.2 U3#2.8(XO) Y3#2.3(OSC2)
NetR8#2_1: R8#2.1 U4#2.23(SCL)
NetR10#2_1: R10#2.1 U4#2.24(SDA)
NetR11#2_1: R11#2.1 R13#2.1 U4#2.9(AD0)
NetR12#2_2: R12#2.2 U4#2.12(INT)

Not connected (* = marked no-connect by the designer): P2#2 1* 6*; P3 4; U1#2 2* 3* 6(DISC)* 7(LINK)* 8(DATA)* 10* 11* 12* 13* 14* 15* 20(RTS) 21(CTS) 22(RST)* 23* 24*; U2#2 9(K)* 10(GND)*; U3#2 9(CTS#) 10(DSR#) 11(RI#) 12(DCD#) 13(DTR#) 14(RTS#) 15(R232); U4#2 2(NC) 3(NC) 4(NC) 5(NC) 6(AUX_DA) 7(AUX_CL) 14(NC) 15(NC) 16(NC) 17(NC) 19(RESV) 21(RESV) 22(RESV)

### Notes on the sheet
- (near P1#2) BLUETOOTH
- TF_CARD
- MPU6050
- USB TO TTL
- CH340G外置晶振，CH340C内置晶振
- (near U4#2) MPU_AD0        IIC_ADRESS
  GND                  0X68
  FLOATING            0X68
  VCC                  0X69

### Library data of the parts
C1#2 C3#2 C5#2 C6#2 C7#2 = 0402 100nF (104) 10% 16V: 贴片电容; ComponentLink1Description: 供应商链接; ComponentLink1URL: http://www.szlcsc.com/product/details_1877.html; Package: 0402; Supplier: LC; SuppliersPartNumber: C1525
C2#2 C4#2 = 0402 10uF (106) 20% 6.3V: 贴片电容; ComponentLink1Description: 供应商链接; ComponentLink1URL: http://www.szlcsc.com/product/details_16204.html; Package: 0402; Supplier: LC; SuppliersPartNumber: C15525
C90 C96 = 0402 22pF (220) 5% 50V: 贴片电容; ComponentLink1Description: 供应商链接; ComponentLink1URL: http://www.szlcsc.com/product/details_1907.html; Package: 0402; Supplier: LC; SuppliersPartNumber: C1555
P1#2 = Header 3X2: Header, 3-Pin, Dual row; LatestRevisionDate: 17-Jul-2002; LatestRevisionNote: Re-released for DXP Platform.; Publisher: Altium Limited
P2#2 = Header 6: Header, 6-Pin; LatestRevisionDate: 17-Jul-2002; LatestRevisionNote: Re-released for DXP Platform.; Publisher: Altium Limited
P3 = Header 5: Header, 5-Pin; LatestRevisionDate: 17-Jul-2002; LatestRevisionNote: Re-released for DXP Platform.; Publisher: Altium Limited
R1#2 R2#2 R3#2 R5#2 R6#2 = 0402 47KΩ (4702) 1%: 贴片电阻; ComponentLink1Description: 供应商链接; ComponentLink1URL: http://www.szlcsc.com/product/details_26535.html; Package: 0402; Supplier: LC; SuppliersPartNumber: C25792
R7#2 R9#2 = 0402 4.7KΩ (4701) 1%: 贴片电阻; ComponentLink1Description: 供应商链接; ComponentLink1URL: http://www.szlcsc.com/product/details_26643.html; Package: 0402; Supplier: LC; SuppliersPartNumber: C25900
R8#2 R10#2 R12#2 R13#2 = 0402 120Ω (1200) 1%: 贴片电阻; ComponentLink1Description: 供应商链接; ComponentLink1URL: http://www.szlcsc.com/product/details_25822.html; Package: 0402; Supplier: LC; SuppliersPartNumber: C25079
R11#2 = 0402 10KΩ (1002) 1%: 贴片电阻; ComponentLink1Description: 供应商链接; ComponentLink1URL: http://www.szlcsc.com/product/details_26487.html; Package: 0402; Supplier: LC; SuppliersPartNumber: C25744
U3#2 = CH340G_[C14267]: USB; ComponentLink1Description: 供应商链接; ComponentLink1URL: http://www.szlcsc.com/product/details_14927.html; Package: SOIC-16_150mil; Supplier: LC; SuppliersPartNumber: C14267
U4#2 = MPU-6050_[C24112]: 传感器; ComponentLink1Description: 供应商链接; ComponentLink1URL: http://www.szlcsc.com/product/details_24852.html; Package: QFN-24_4x4x05P; Supplier: LC; SuppliersPartNumber: C24112
Y3#2 = SMD-3225_4P  12MHZ 20PF 10PPM: 贴片晶振; ComponentLink1Description: 供应商链接; ComponentLink1URL: http://www.szlcsc.com/product/details_9522.html; Package: SMD-3225_4P; Supplier: LC; SuppliersPartNumber: C9002

## Nets that join several sheets
AGND: EEG (8 pins), STM32F4 (38 pins), pwr (38 pins), ble (20 pins)
AVDD: EEG (16 pins), pwr (C24#2.2 C28.2 L3.2 P5.9)
AVSS: EEG (20 pins), pwr (C28.1 C33.2 L4.2 P5.10)
DVDD: EEG (5 pins), STM32F4 (33 pins), pwr (C27.2 P5.5 P5.7 U8.5), ble (11 pins)
USB_5V: pwr (8 pins), ble (P3.1)
VCC: pwr (13 pins), ble (6 pins)
PA11: STM32F4 (U12.103), ble (U1#2.4)
PA12: STM32F4 (U12.104), ble (U1#2.5)
PD7: EEG (P2#1.2), STM32F4 (U12.123)
PE2: EEG (P2#1.10), STM32F4 (U12.1)
PE3: EEG (P2#1.8), STM32F4 (U12.2)
SPI3_MISO: EEG (P2#1.4), STM32F4 (U12.134)
SPI3_MOSI: EEG (P2#1.12), STM32F4 (U12.135)
SPI3_SCK: EEG (P2#1.6), STM32F4 (U12.133)
USART1_RX: STM32F4 (U12.102), ble (U3#2.2)
USART1_TX: STM32F4 (U12.101), ble (U3#2.3)
USART3_RX: STM32F4 (U12.112), ble (P1#2.4)
USART3_TX: STM32F4 (U12.111), ble (P1#2.3)